# EAGLE schematic arduino_miniuno (EAGLE 6.6.0)
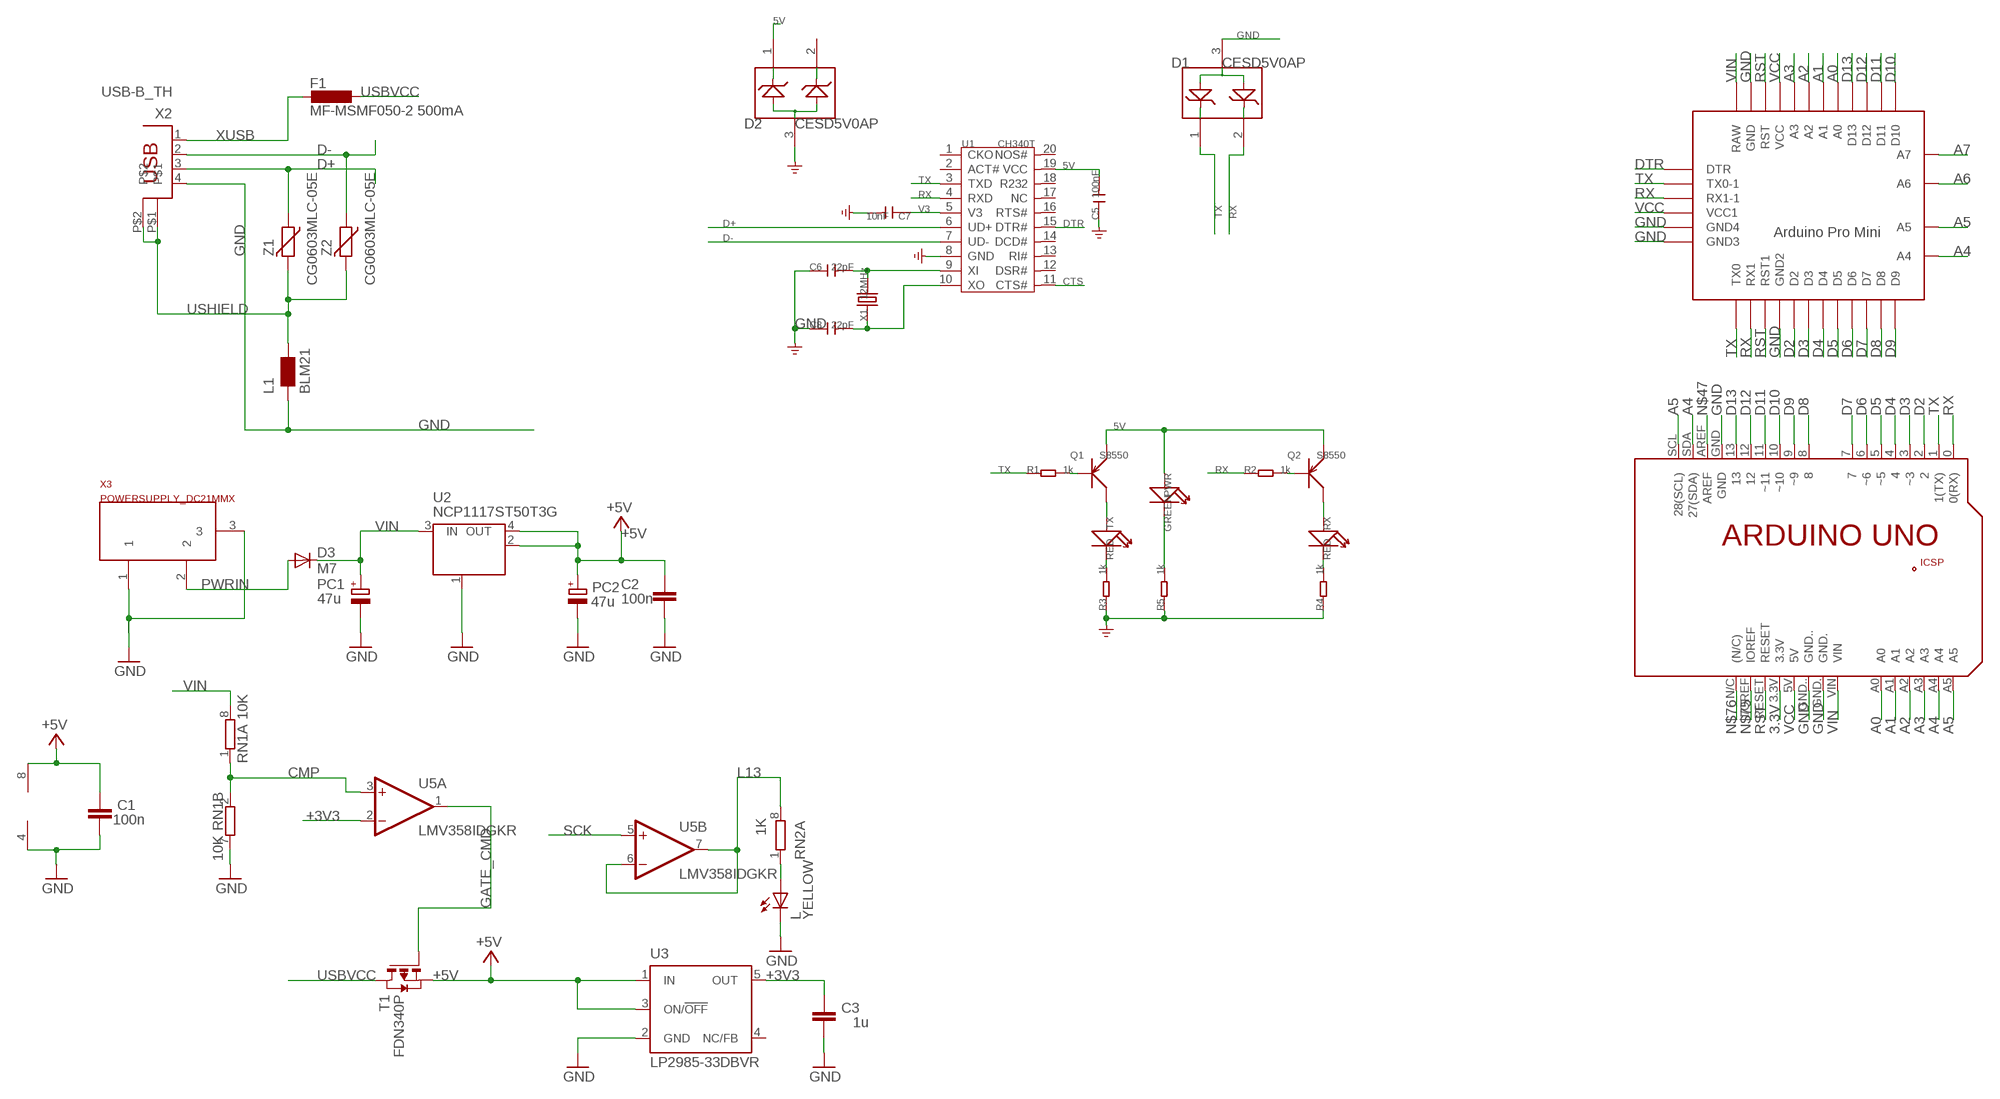
[diagram p0: schematic, sheet 1]

## Parts
C1  100n  C-EU0603-RND  [C0603-ROUND]
C2  100n  C-EU0603-RND  [C0603-ROUND]
C3  1u  C-EU0603-RND  [C0603-ROUND]
C5  100nF  C-0402  [C0402]
C6  22pF  C-0402  [C0402]
C7  10nF  C-0402  [C0402]
C8  22pF  C-0402  [C0402]
D1  CESD5V0AP  D-ESD-3P  [SOT23]
D2  CESD5V0AP  D-ESD-3P  [SOT23]
D3  M7  DIODE-SMB  [SMB]
F1  MF-MSMF050-2 500mA  L-EUL1812  [L1812]
L  YELLOW  LEDCHIP-LED0805  [CHIP-LED0805]
L1  BLM21  WE-CBF_0805  [0805]
PC1  47u  CPOL-EUD  [PANASONIC_D]
PC2  47u  CPOL-EUD  [PANASONIC_D]
PCB1  ARDUINO_UNO  [ARDUINO_UNO]
PWR  GREEN  LED'0603'  [LED-0603]
Q1  S8550  TRANSISTOR-PNP-SOT23  [SOT23]
Q2  S8550  TRANSISTOR-PNP-SOT23  [SOT23]
R1  1k  R-0402  [R0402]
R2  1k  R-0402  [R0402]
R3  1k  R-0402  [R0402]
R4  1k  R-0402  [R0402]
R5  1k  R-0402  [R0402]
RN1  10K  4R-NCAY16  [CAY16]
RN2  1K  4R-NCAY16  [CAY16]
RX  RED  LED'0603'  [LED-0603]
T1  FDN340P  PMOSSOT23  [SOT-23]
TX  RED  LED'0603'  [LED-0603]
U1  CH340T  [SSOP20]
U2  NCP1117ST50T3G  MC33269ST-3.3T3  [SOT223]
U3  LP2985-33DBVR  LP2985-XXDBVR33  [SOT23-DBV]
U5  LMV358IDGKR  LMV358MMX  [MSOP08]
U$3  PRO-MINI-2  [PRO-MINI-2]
X1  12MHz  CRYSTAL'HC49UP'  [HC49UP]
X2  USB-B_TH  PN61729  [PN61729]
X3  POWERSUPPLY_DC21MMX  [POWERSUPPLY_DC-21MM]
Z1  CG0603MLC-05E  VARISTORCN0603  [CT/CN0603]
Z2  CG0603MLC-05E  VARISTORCN0603  [CT/CN0603]

## Nets
3.3V: PCB1.3.3V
5V: C5.2 D2.1 PWR.+ Q1.2(E) Q2.2(E) U1.19(VCC)
+3V3: C3.2 U3.5(OUT) U5.2(A:-IN)
+5V [usbvcc]: C1.2 C2.2 PC2.+ T1.2(S) U2.2(OUT) U2.4(OUT) U3.1(IN) U3.3(ON/!OFF) U5.8(P:V+)
A0: PCB1.A0 U$3.A0
A1: PCB1.A1 U$3.A1
A2: PCB1.A2 U$3.A2
A3: PCB1.A3 U$3.A3
A4: PCB1.A4 PCB1.SDA(27(SDA)) U$3.A4
A5: PCB1.A5 PCB1.SCL(28(SCL)) U$3.A5
A6: U$3.A6
A7: U$3.A7
CMP: RN1.1 RN1.2 U5.3(A:+IN)
CTS: U1.11(CTS#)
D2: PCB1.2 U$3.D2
D3: PCB1.3(~3) U$3.D3
D4: PCB1.4 U$3.D4
D5: PCB1.5(~5) U$3.D5
D6: PCB1.6(~6) U$3.D6
D7: PCB1.7 U$3.D7
D8: PCB1.8 U$3.D8
D9: PCB1.9(~9) U$3.D9
D10: PCB1.10(~10) U$3.D10
D11: PCB1.11(~11) U$3.D11
D12: PCB1.12 U$3.D12
D13: PCB1.13 U$3.D13
D+: U1.6(UD+) X2.3 Z1.1
D-: U1.7(UD-) X2.2 Z2.1
DTR: U1.15(DTR#) U$3.DTR
GATE_CMD: T1.3(G) U5.1(A:OUT)
GND: C1.1 C2.1 C3.1 C5.1 C6.1 C7.2 C8.1 D1.3 D2.3 L1.1 L.C PC1.- PC2.- PCB1.GND PCB1.GND. PCB1.GND.. R3.1 R4.1 R5.1 RN1.7 U1.8(GND) U2.1(GND/ADJ) U3.2(GND) U5.4(P:V-) U$3.GND U$3.GND1(GND2) U$3.GND2(GND3) U$3.GND3(GND4) X2.4 X3.1 X3.3
L13: RN2.8 U5.6(B:-IN) U5.7(B:OUT)
N$1: Q1.3(C) TX.+
N$2: Q2.3(C) RX.+
N$3: L.A RN2.1
N$4: C6.2 U1.9(XI) X1.2
N$5: C8.2 U1.10(XO) X1.1
N$6: R3.2 TX.-
N$7: Q1.1(B) R1.2
N$8: Q2.1(B) R2.2
N$10: R4.2 RX.-
N$12: PWR.- R5.2
N$47: PCB1.AREF
N$75: PCB1.I/OREF(IOREF)
N$76: PCB1.N/C((N/C))
PWRIN [power]: D3.A X3.2
RST: PCB1.RESET U$3.RST U$3.RST1
RX: D1.2 PCB1.0(0(RX)) R2.1 U1.4(RXD) U$3.RX1 U$3.RX1-1
SCK: U5.5(B:+IN)
TX: D1.1 PCB1.1(1(TX)) R1.1 U1.3(TXD) U$3.TX0 U$3.TX0-1
USBVCC [usbvcc]: F1.1 T1.1(D)
USHIELD [gnd]: L1.2 X2.P$1 X2.P$2 Z1.2 Z2.2
V3: C7.1 U1.5(V3)
VCC: PCB1.5V U$3.VCC U$3.VCC1
VIN [power]: D3.C PC1.+ PCB1.VIN RN1.8 U2.3(IN) U$3.RAW
XUSB [usbvcc]: F1.2 X2.1
Unconnected: D2.2 PCB1.+5V PCB1.GND_ PCB1.MISO PCB1.MOSI PCB1.RESET. PCB1.SCK RN1.3 RN1.4 RN1.5 RN1.6 RN2.2 RN2.3 RN2.4 RN2.5 RN2.6 RN2.7 U1.1(CKO) U1.2(ACT#) U1.12(DSR#) U1.13(RI#) U1.14(DCD#) U1.16(RTS#) U1.17(NC) U1.18(R232) U1.20(NOS#) U3.4(NC/FB)

## Library data of the parts
C1-C3 = SmartPrj:C-EU: CAPACITOR, European symbol
C5-C8 = Discrete:C*: Ceramic Capacitors
D1 D2 = Discrete:D-ESD-3P
D3 = diode:DIODE-: DIODE
F1 = rcl:L-EU: INDUCTOR, European symbol
L = led:LED: LED OSRAM: - CHIPLED LG R971, LG N971, LY N971, LG Q971, LY Q971, LO R971, LY R971 LH N974, LH R974 LS Q976, LO Q976, LY Q976 LO Q996 - Hyper CHIPLED LW Q18S LB Q993, LB Q99A, LB R99A - SideLED LS A670, LO A670, LY A670, LG A670, LP A670 LB A673, LV A673, LT A673, LW A673 LH A674 LY A675 LS A676, LA A676, LO A676, LY A676, LW A676 LS A679, LY A679, LG A679 - Hyper Micro SIDELED® LS Y876, LA Y876, LO Y876, LY Y876 LT Y87S - SmartLED LW L88C, LW L88S LB L89C, LB L89S, LG L890 LS L89K, LO L89K, LY L89K LS L896, LA L896, LO L896, LY L896 - TOPLED LS T670, LO T670, LY T670, LG T670, LP T670 LSG T670, LSP T670, LSY T670, LOP T670, LYG T670 LG T671, LOG T671, LSG T671 LB T673, LV T673, LT T673, LW T673 LH T674 LS T676, LA T676, LO T676, LY T676, LB T676, LH T676, LSB T676, LW T676 LB T67C, LV T67C, LT T67C, LS T67K, LO T67K, LY T67K, LW E67C LS E67B, LA E67B, LO E67B, LY E67B, LB E67C, LV E67C, LT E67C LW T67C LS T679, LY T679, LG T679 LS T770, LO T770, LY T770, LG T770, LP T770 LB T773, LV T773, LT T773, LW T773 LH T774 LS E675, LA E675, LY E675, LS T675 LS T776, LA T776, LO T776, LY T776, LB T776 LHGB T686 LT T68C, LB T68C - Hyper Mini TOPLED® LB M676 - Mini TOPLED Santana® LG M470 LS M47K, LO M47K, LY M47K Source: http://www.osram.convergy.de LUXEON: - LUMILED® LXK2-PW12-R00, LXK2-PW12-S00, LXK2-PW14-U00, LXK2-PW14-V00 LXK2-PM12-R00, LXK2-PM12-S00, LXK2-PM14-U00 LXK2-PE12-Q00, LXK2-PE12-R00, LXK2-PE12-S00, LXK2-PE14-T00, LXK2-PE14-U00 LXK2-PB12-K00, LXK2-PB12-L00, LXK2-PB12-M00, LXK2-PB14-N00, LXK2-PB14-P00, LXK2-PB14-Q00 LXK2-PR12-L00, LXK2-PR12-M00, LXK2-PR14-Q00, LXK2-PR14-R00 LXK2-PD12-Q00, LXK2-PD12-R00, LXK2-PD12-S00 LXK2-PH12-R00, LXK2-PH12-S00 LXK2-PL12-P00, LXK2-PL12-Q00, LXK2-PL12-R00 Source: www.luxeon.com KINGBRIGHT: KA-3528ASYC Source: www.kingbright.com
L1 = wuerth-elektronik:WE-CBF: SMD EMI Suppression Ferrite Beads - excellent anti-EMI properties - low DCR - impedances till 3000 ohms - rated current up to 6 A
PC1 PC2 = rcl:CPOL-EU: POLARIZED CAPACITOR, European symbol
PCB1 = E14_Arduino_revB:ARDUINO_UNO: Device for representing an Arduino Uno board with a footprint in an EAGLE design. Created by Dave Young for Element14. More EAGLE documentation at: http://www.element14.com/community/community/knode/cadsoft_eagle
PWR RX TX = Discrete:LED*
Q1 Q2 = Discrete:TRANSISTOR-PNP*: PNP audion
R1-R5 = Discrete:R*
RN1 RN2 = resistor-dil:4R-N: Array Chip Resistor Source: RS Component / Phycomp
T1 = zetex:PMOSSOT23: MOS FET
U1 = template:CH340T
U2 = linear:MC33269ST*: Adjustable Output Low Dropout Voltage Regulator 800 mA Source: http://www.onsemi.com/pub/Collateral/MC33269-D.PDF
U3 = SmartPrj:LP2985-XXDBVR: ULTRALOW-POWER 50-mA LOW-DROPOUT LINEAR REGULATORS 50-mA Low-Dropout Regulator Source: http://focus.ti.com/lit/ds/symlink/tps77001.pdf
U5 = linear:LMV358?*: Dual General Purpose, Low Voltage, Rail-to-Rail Output Operational Amplifiers Source: http://www.national.com/mpf/LM/LMV321.html http://www.national.com/dt/lmv_qual.pdf
U$3 = Arduino-clone:PRO-MINI-2: Arduino Pro Mini Layout 2 Sparkfun.com
X1 = Discrete:CRYSTAL*: CRYSTAL
X2 = SmartPrj:PN61729: BERG USB connector
X3 = SmartPrj:POWERSUPPLY_DC21MM
Z1 Z2 = varistor:VARISTOR: VARISTOR

## Net classes
0 default: width 0.254 mm, clearance 0.254 mm
1 power: width 0.61 mm, drill 0.61 mm, clearance 0.254 mm
2 gnd: width 0.305 mm, drill 0.559 mm, clearance 0.254 mm
3 usbvcc: width 0.508 mm, drill 0.61 mm, clearance 0.254 mm